# EAGLE design item_2223_Motherboard (EAGLE 7.7.0)

## Sheet 1 of 2
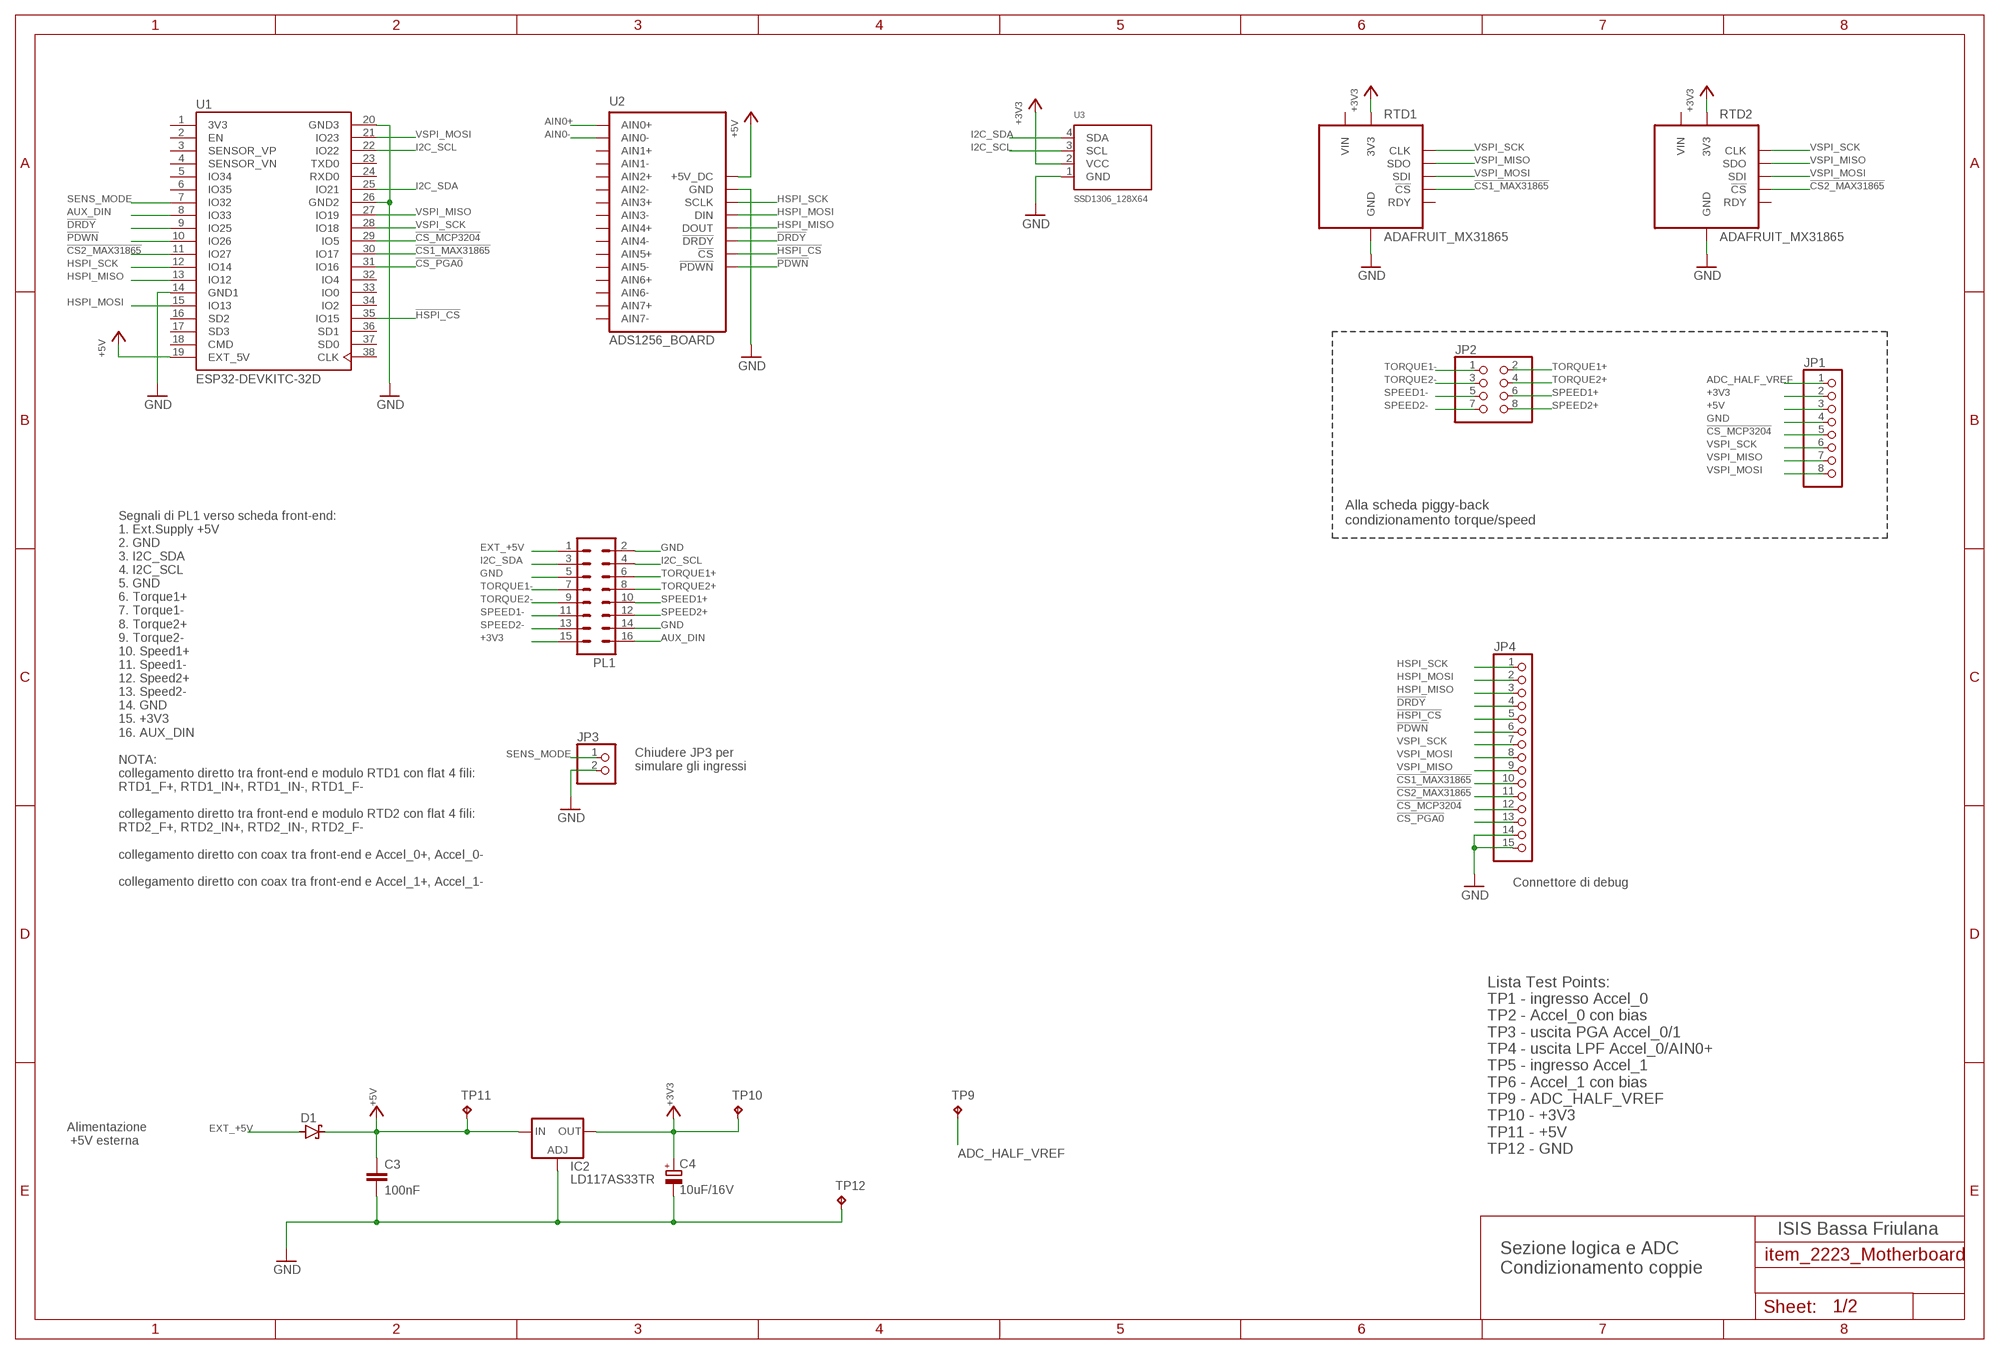
[diagram p0: schematic, sheet 1]

### Parts
C3  100nF  C-EUC0805K  [C0805K]
C4  10uF/16V  CPOL-EUE3.5-8  [E3,5-8]
D1  SCHOTTKY-DIODEDO35-7  [DO35-7]
IC2  LD117AS33TR  [SOT223]
JP1  PINHD-1X8  [1X08]
JP2  PINHD-2X4  [2X04]
JP3  PINHD-1X2  [1X02]
JP4  PINHD-1X15  [1X15]
PL1  16H  [16H]
RTD1  ADAFRUIT_MX31865  [ADAFRUIT_MAX31865]
RTD2  ADAFRUIT_MX31865  [ADAFRUIT_MAX31865]
TP9  TPTP16SQ  [TP16SQ]
TP10  TPTP16SQ  [TP16SQ]
TP11  TPTP16SQ  [TP16SQ]
TP12  TPTP14R  [TP14R]
U1  ESP32-DEVKITC-32D  [MODULE_ESP32-DEVKITC-32D]
U2  ADS1256_BOARD  [ADS1256_BOARD]
U3  SSD1306_128X64  [128X64]

### Nets
!CS1_MAX31865! [digital]: JP4.10 RTD1.P7(!CS!) U1.30(IO17)
!CS2_MAX31865! [digital]: JP4.11 RTD2.P7(!CS!) U1.11(IO27)
!CS_MCP3204! [digital]: JP1.5 JP4.12 U1.29(IO5)
!CS_PGA0! [digital]: JP4.13 U1.31(IO16) ; also sheet 2
!DRDY! [digital]: JP4.4 U1.9(IO25) U2.!DRDY!
!HSPI_CS! [digital]: JP4.5 U1.35(IO15) U2.!CS!
!PDWN! [digital]: JP4.6 U1.10(IO26) U2.PDWN(!PDWN!)
+3V3 [supply]: C4.+ IC2.4(OUT) JP1.2 PL1.15 RTD1.P3(3V3) RTD2.P3(3V3) TP10.TP U3.2(VCC) ; also sheet 2
+5V [supply]: C3.1 D1.C IC2.3(IN) JP1.3 TP11.TP U1.19(EXT_5V) U2.5V_DC(+5V_DC) ; also sheet 2
ADC_HALF_VREF [supply]: JP1.1 TP9.TP ; also sheet 2
AIN0+ [analog]: U2.AIN0+ ; also sheet 2
AIN0- [analog]: U2.AIN0- ; also sheet 2
AUX_DIN [digital]: PL1.16 U1.8(IO33)
EXT_+5V [supply]: D1.A PL1.1
GND [supply]: C3.2 C4.- IC2.1(ADJ) JP1.4 JP3.2 JP4.14 JP4.15 PL1.2 PL1.5 PL1.14 RTD1.P2(GND) RTD2.P2(GND) TP12.TP U1.14(GND1) U1.20(GND3) U1.26(GND2) U2.GND U3.1(GND) ; also sheet 2
HSPI_MISO [digital]: JP4.3 U1.13(IO12) U2.DOUT
HSPI_MOSI [digital]: JP4.2 U1.15(IO13) U2.DIN
HSPI_SCK [digital]: JP4.1 U1.12(IO14) U2.SCLK
I2C_SCL [digital]: PL1.4 U1.22(IO22) U3.3(SCL)
I2C_SDA [digital]: PL1.3 U1.25(IO21) U3.4(SDA)
SENS_MODE [digital]: JP3.1 U1.7(IO32)
SPEED1+ [analog]: JP2.6 PL1.10
SPEED1- [analog]: JP2.5 PL1.11
SPEED2+ [analog]: JP2.8 PL1.12
SPEED2- [analog]: JP2.7 PL1.13
TORQUE1+ [analog]: JP2.2 PL1.6
TORQUE1- [analog]: JP2.1 PL1.7
TORQUE2+ [analog]: JP2.4 PL1.8
TORQUE2- [analog]: JP2.3 PL1.9
VSPI_MISO [digital]: JP1.7 JP4.9 RTD1.P5(SDO) RTD2.P5(SDO) U1.27(IO19)
VSPI_MOSI [digital]: JP1.8 JP4.8 RTD1.P6(SDI) RTD2.P6(SDI) U1.21(IO23) ; also sheet 2
VSPI_SCK [digital]: JP1.6 JP4.7 RTD1.P4(CLK) RTD2.P4(CLK) U1.28(IO18) ; also sheet 2
Unconnected: RTD1.P8(RDY) RTD2.P8(RDY) U1.2(EN) U1.3(SENSOR_VP) U1.4(SENSOR_VN) U1.5(IO34) U1.6(IO35) U1.16(SD2) U1.17(SD3) U1.18(CMD) U1.23(TXD0) U1.24(RXD0) U1.32(IO4) U1.33(IO0) U1.34(IO2) U1.36(SD1) U1.37(SD0) U1.38(CLK) U2.AIN1+ U2.AIN1- U2.AIN2+ U2.AIN2- U2.AIN3+ U2.AIN3- U2.AIN4+ U2.AIN4- U2.AIN5+ U2.AIN5- U2.AIN6+ U2.AIN6- U2.AIN7+ U2.AIN7-

### Notes on the sheet
- Alla scheda piggy-back
  condizionamento torque/speed
- Chiudere JP3 per
  simulare gli ingressi
- Connettore di debug
- Segnali di PL1 verso scheda front-end:
  1. Ext.Supply +5V
  2. GND
  3. I2C_SDA
  4. I2C_SCL
  5. GND
  6. Torque1+
  7. Torque1-
  8. Torque2+
  9. Torque2-
  10. Speed1+
  11. Speed1-
  12. Speed2+
  13. Speed2-
  14. GND
  15. +3V3
  16. AUX_DIN
  
  NOTA:
  collegamento diretto tra front-end e modulo RTD1 con flat 4 fili:
  RTD1_F+, RTD1_IN+, RTD1_IN-, RTD1_F-
  
  collegamento diretto tra front-end e modulo RTD2 con flat 4 fili:
  RTD2_F+, RTD2_IN+, RTD2_IN-, RTD2_F-
  
  collegamento diretto con coax tra front-end e Accel_0+, Accel_0-
  
  collegamento diretto con coax tra front-end e Accel_1+, Accel_1-
- Alimentazione
   +5V esterna
- Lista Test Points:
  TP1 - ingresso Accel_0
  TP2 - Accel_0 con bias
  TP3 - uscita PGA Accel_0/1
  TP4 - uscita LPF Accel_0/AIN0+
  TP5 - ingresso Accel_1
  TP6 - Accel_1 con bias
  TP9 - ADC_HALF_VREF
  TP10 - +3V3
  TP11 - +5V
  TP12 - GND
- ISIS Bassa Friulana
- Sezione logica e ADC
  Condizionamento coppie

## Sheet 2 of 2
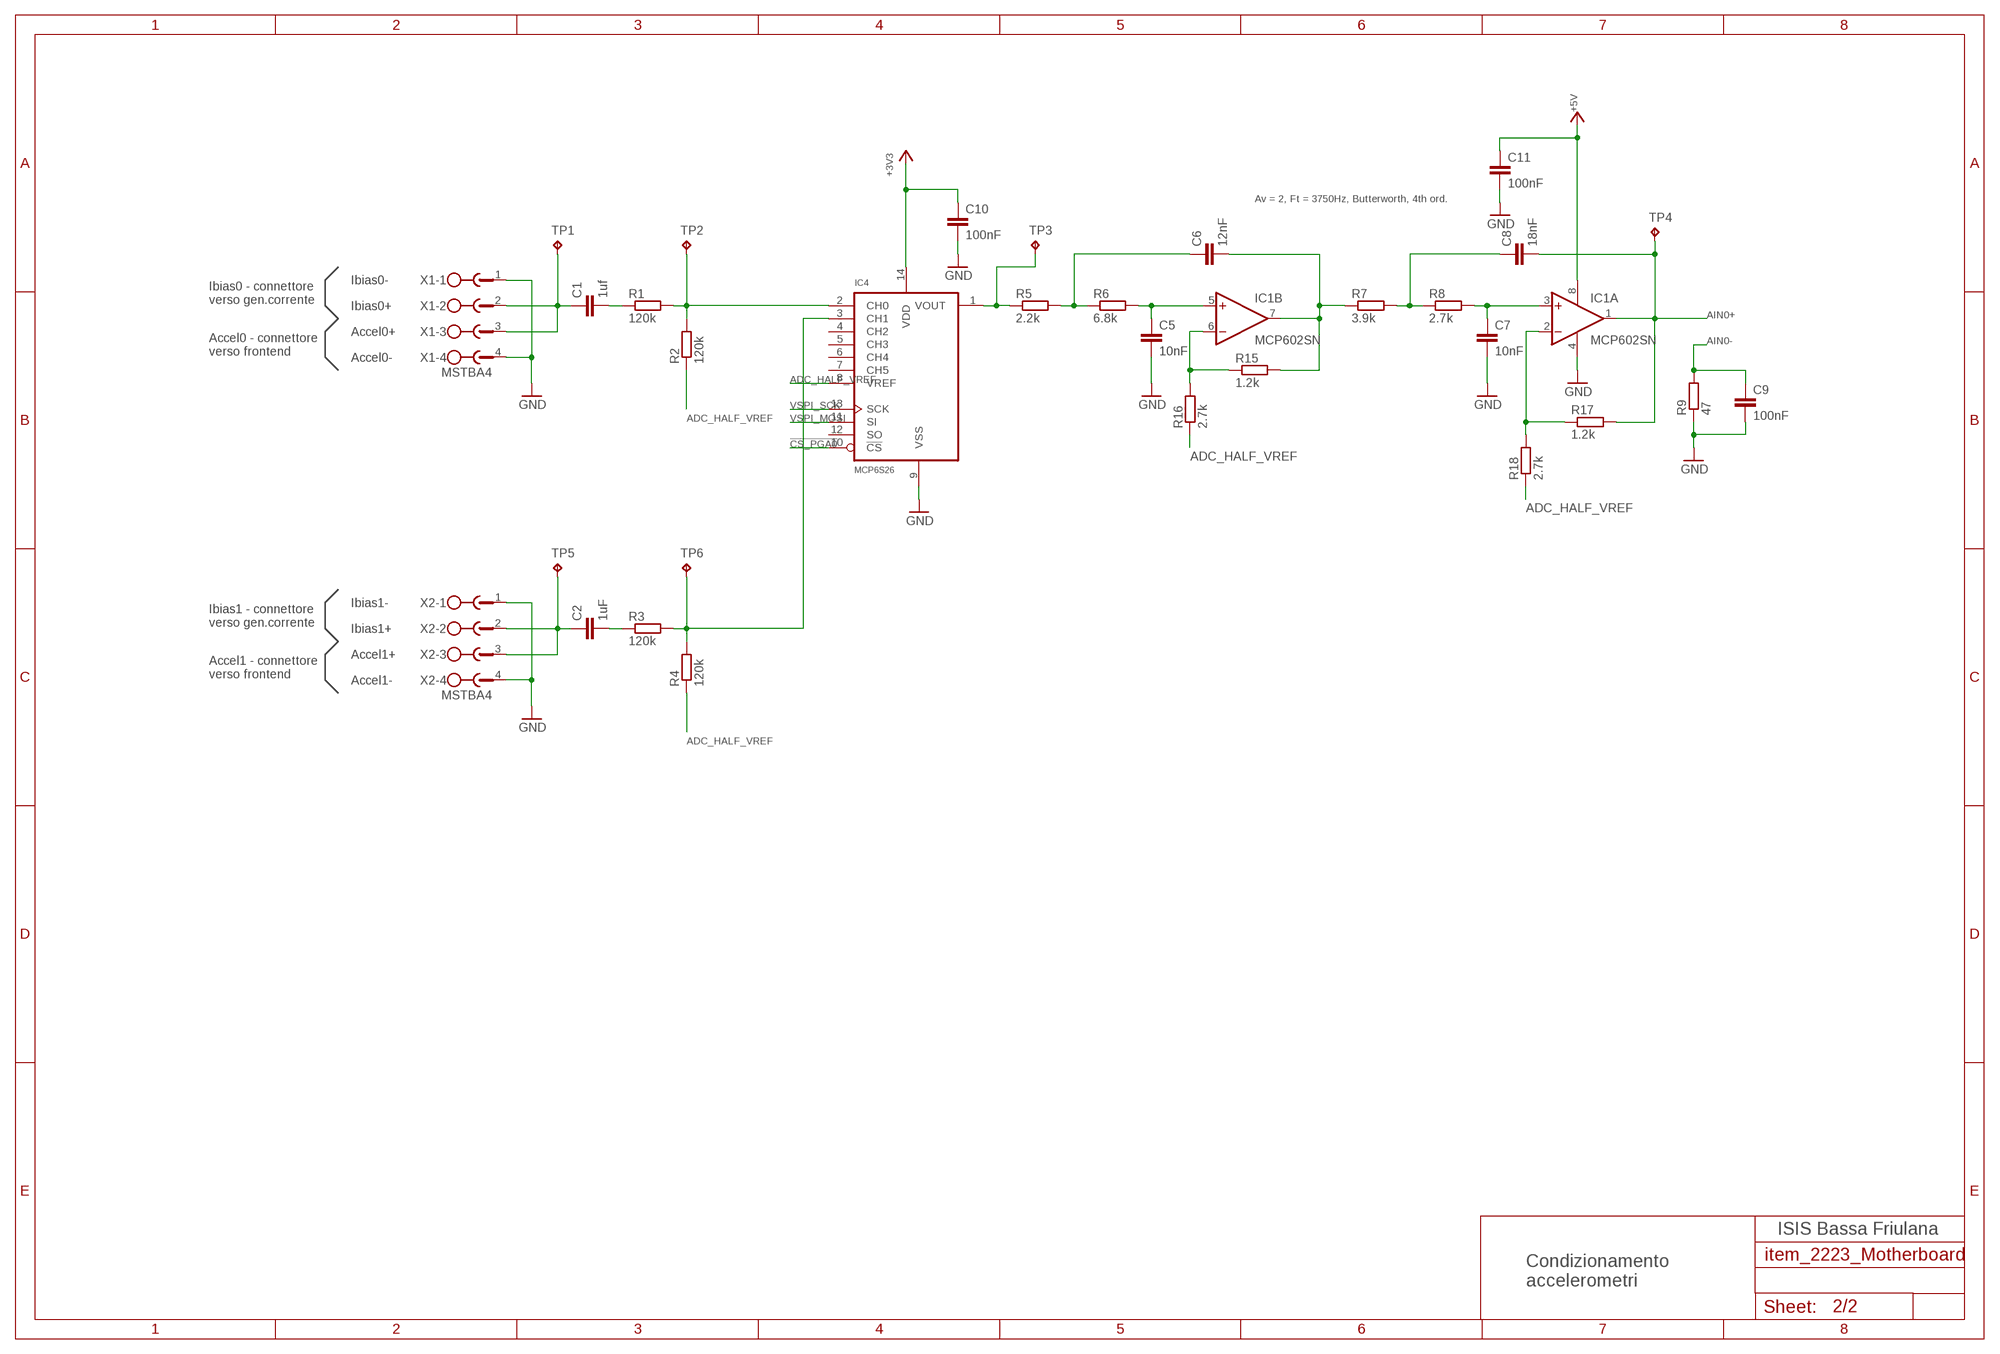
[diagram p1: schematic, sheet 2]

### Parts
C1  1uf  C-EUC1206  [C1206]
C2  1uF  C-EUC1206  [C1206]
C5  10nF  C-EUC0805K  [C0805K]
C6  12nF  C-EUC0805K  [C0805K]
C7  10nF  C-EUC0805K  [C0805K]
C8  18nF  C-EUC0805K  [C0805K]
C9  100nF  C-EUC0805K  [C0805K]
C10  100nF  C-EUC0805K  [C0805K]
C11  100nF  C-EUC0805K  [C0805K]
IC1  MCP602SN  [SO08]
IC4  MCP6S26  [SO14]
R1  120k  R-EU_R0805  [R0805]
R2  120k  R-EU_R0805  [R0805]
R3  120k  R-EU_R0805  [R0805]
R4  120k  R-EU_R0805  [R0805]
R5  2.2k  R-EU_R0805  [R0805]
R6  6.8k  R-EU_R0805  [R0805]
R7  3.9k  R-EU_R0805  [R0805]
R8  2.7k  R-EU_R0805  [R0805]
R9  47  R-EU_R0805  [R0805]
R15  1.2k  R-EU_R0805  [R0805]
R16  2.7k  R-EU_R0805  [R0805]
R17  1.2k  R-EU_R0805  [R0805]
R18  2.7k  R-EU_R0805  [R0805]
TP1  TPTP14R  [TP14R]
TP2  TPTP14R  [TP14R]
TP3  TPTP14R  [TP14R]
TP4  TPTP14R  [TP14R]
TP5  TPTP14R  [TP14R]
TP6  TPTP14R  [TP14R]
X1  MSTBA4  [MSTBA4]
X2  MSTBA4  [MSTBA4]

### Nets
!CS_PGA0! [digital]: IC4.10(!CS!) ; also sheet 1
+3V3 [supply]: C10.1 IC4.14(VDD) ; also sheet 1
+5V [supply]: C11.1 IC1.8(P:V+) ; also sheet 1
ADC_HALF_VREF [supply]: IC4.8(VREF) R2.1 R4.1 R16.1 R18.1 ; also sheet 1
AIN0+ [analog]: C8.2 IC1.1(A:OUT) R17.2 TP4.TP ; also sheet 1
AIN0- [analog]: C9.1 R9.2 ; also sheet 1
GND [supply]: C5.2 C7.2 C9.2 C10.2 C11.2 IC1.4(P:V-) IC4.9(VSS) R9.1 X1.1 X1.4 X2.1 X2.4 ; also sheet 1
N$2 [analog]: C1.1 TP1.TP X1.2 X1.3
N$3 [analog]: C2.1 TP5.TP X2.2 X2.3
N$4 [analog]: IC4.2(CH0) R1.2 R2.2 TP2.TP
N$5 [analog]: IC4.1(VOUT) R5.1 TP3.TP
N$6 [analog]: C1.2 R1.1
N$7: C2.2 R3.1
N$8 [analog]: IC1.6(B:-IN) R15.1 R16.2
N$9 [analog]: C6.1 R5.2 R6.1
N$10 [analog]: C5.1 IC1.5(B:+IN) R6.2
N$11 [analog]: C6.2 IC1.7(B:OUT) R7.1 R15.2
N$12 [analog]: C8.1 R7.2 R8.1
N$13 [analog]: C7.1 IC1.3(A:+IN) R8.2
N$14 [analog]: IC4.3(CH1) R3.2 R4.2 TP6.TP
N$21 [analog]: IC1.2(A:-IN) R17.1 R18.2
VSPI_MOSI [digital]: IC4.11(SI) ; also sheet 1
VSPI_SCK [digital]: IC4.13(SCK) ; also sheet 1
Unconnected: IC4.4(CH2) IC4.5(CH3) IC4.6(CH4) IC4.7(CH5) IC4.12(SO)

### Notes on the sheet
- Av = 2, Ft = 3750Hz, Butterworth, 4th ord.
- Ibias0-
- Ibias0 - connettore 
  verso gen.corrente
- Ibias0+
- Accel0+
- Accel0 - connettore 
  verso frontend
- Accel0-
- Ibias1-
- Ibias1 - connettore 
  verso gen.corrente
- Ibias1+
- Accel1+
- Accel1 - connettore 
  verso frontend
- Accel1-
- ISIS Bassa Friulana
- Condizionamento
  accelerometri

## Power pins joined to a net without a drawn wire
3V3: U1.1(3V3)
VIN: RTD1.P1(VIN) RTD2.P1(VIN)

## Library data of the parts
C1-C3 C5-C11 = rcl:C-EU: CAPACITOR, European symbol; SPICEPREFIX: C
C4 = rcl@1:CPOL-EU: POLARIZED CAPACITOR, European symbol
D1 = diode:SCHOTTKY-DIODE: Schottky Diode
IC1 = linear:MCP602: Single Op Amp 2.7V to 6.0V Single Supply CMOS Source: http://ww1.microchip.com/downloads/en/DeviceDoc/21314g.pdf
IC2 = v-reg:LD117A?*: Low drop fixed and adjustable positive voltage regulators 1 A Source: http://www.st.com/stonline/products/literature/ds/7194/ld1117axx.pdf
IC4 = microchip_opamp:MCP6S26: MCP6S26 Six channels analog Programmable Gain Amplifier with SPI interface
JP1 = pinhead:PINHD-1X8: PIN HEADER
JP2 = pinhead:PINHD-2X4: PIN HEADER
JP3 = pinhead:PINHD-1X2: PIN HEADER
JP4 = pinhead:PINHD-1X15: PIN HEADER
PL1 = con-harting-h:16H: CONNECTOR; OC_FARNELL: unknown; OC_NEWARK: unknown
R1-R9 R15-R18 = rcl:R-EU_: RESISTOR, European symbol; SPICEPREFIX: R
RTD1 RTD2 = Adafruit_MAX31865_RTD:ADAFRUIT_MX31865: Adafruit MAX31865 - Adafruit MAX31865 RTD PT100 or PT1000 Amplifier
TP1-TP6 TP9-TP12 = testpad:TP: Test pad
U1 = ESP32-DEVKITC-32D:ESP32-DEVKITC-32D: Eval Board For Esp-Wroom-32 Check prices <https://pricing.snapeda.com/parts/ESP32-DEVKITC-32D/Espressif%20Systems/view-part?ref=eda>; AVAILABILITY: Warning; DESCRIPTION: WiFi Development Tools (802.11) ESP32 General Development Kit, ESP32-WROOM-32D on the board; MF: Espressif Systems; MP: ESP32-DEVKITC-32D; PACKAGE: None; PRICE: None; PURCHASE-URL: https://pricing.snapeda.com/search/part/ESP32-DEVKITC-32D/?ref=eda
U2 = ADS1256:ADS1256_BOARD: Board 8 Channels - ADS1256 24bit
U3 = ssd1306oled:SSD1306_128X64: OLED Display Board 0.91" 128x64 White I2C - 4 Pins - SSD1306
X1 X2 = con-phoenix-508:MSTBA4: PHOENIX; MF: FARNELL; MPN: 1757268; OC_FARNELL: 3705195; OC_NEWARK: 71C4163

## Net classes
1 supply: width 0.762 mm, drill 0.508 mm, clearance 0.406 mm to class 0, clearance 0.406 mm
2 digital: width 0.305 mm, drill 0.305 mm, clearance 0.305 mm to class 0, clearance 0.305 mm to class 1, clearance 0.305 mm
3 analog: width 0.508 mm, drill 0.508 mm, clearance 0.406 mm to class 0, clearance 0.406 mm to class 1, clearance 0.406 mm to class 2, clearance 0.406 mm

## Board
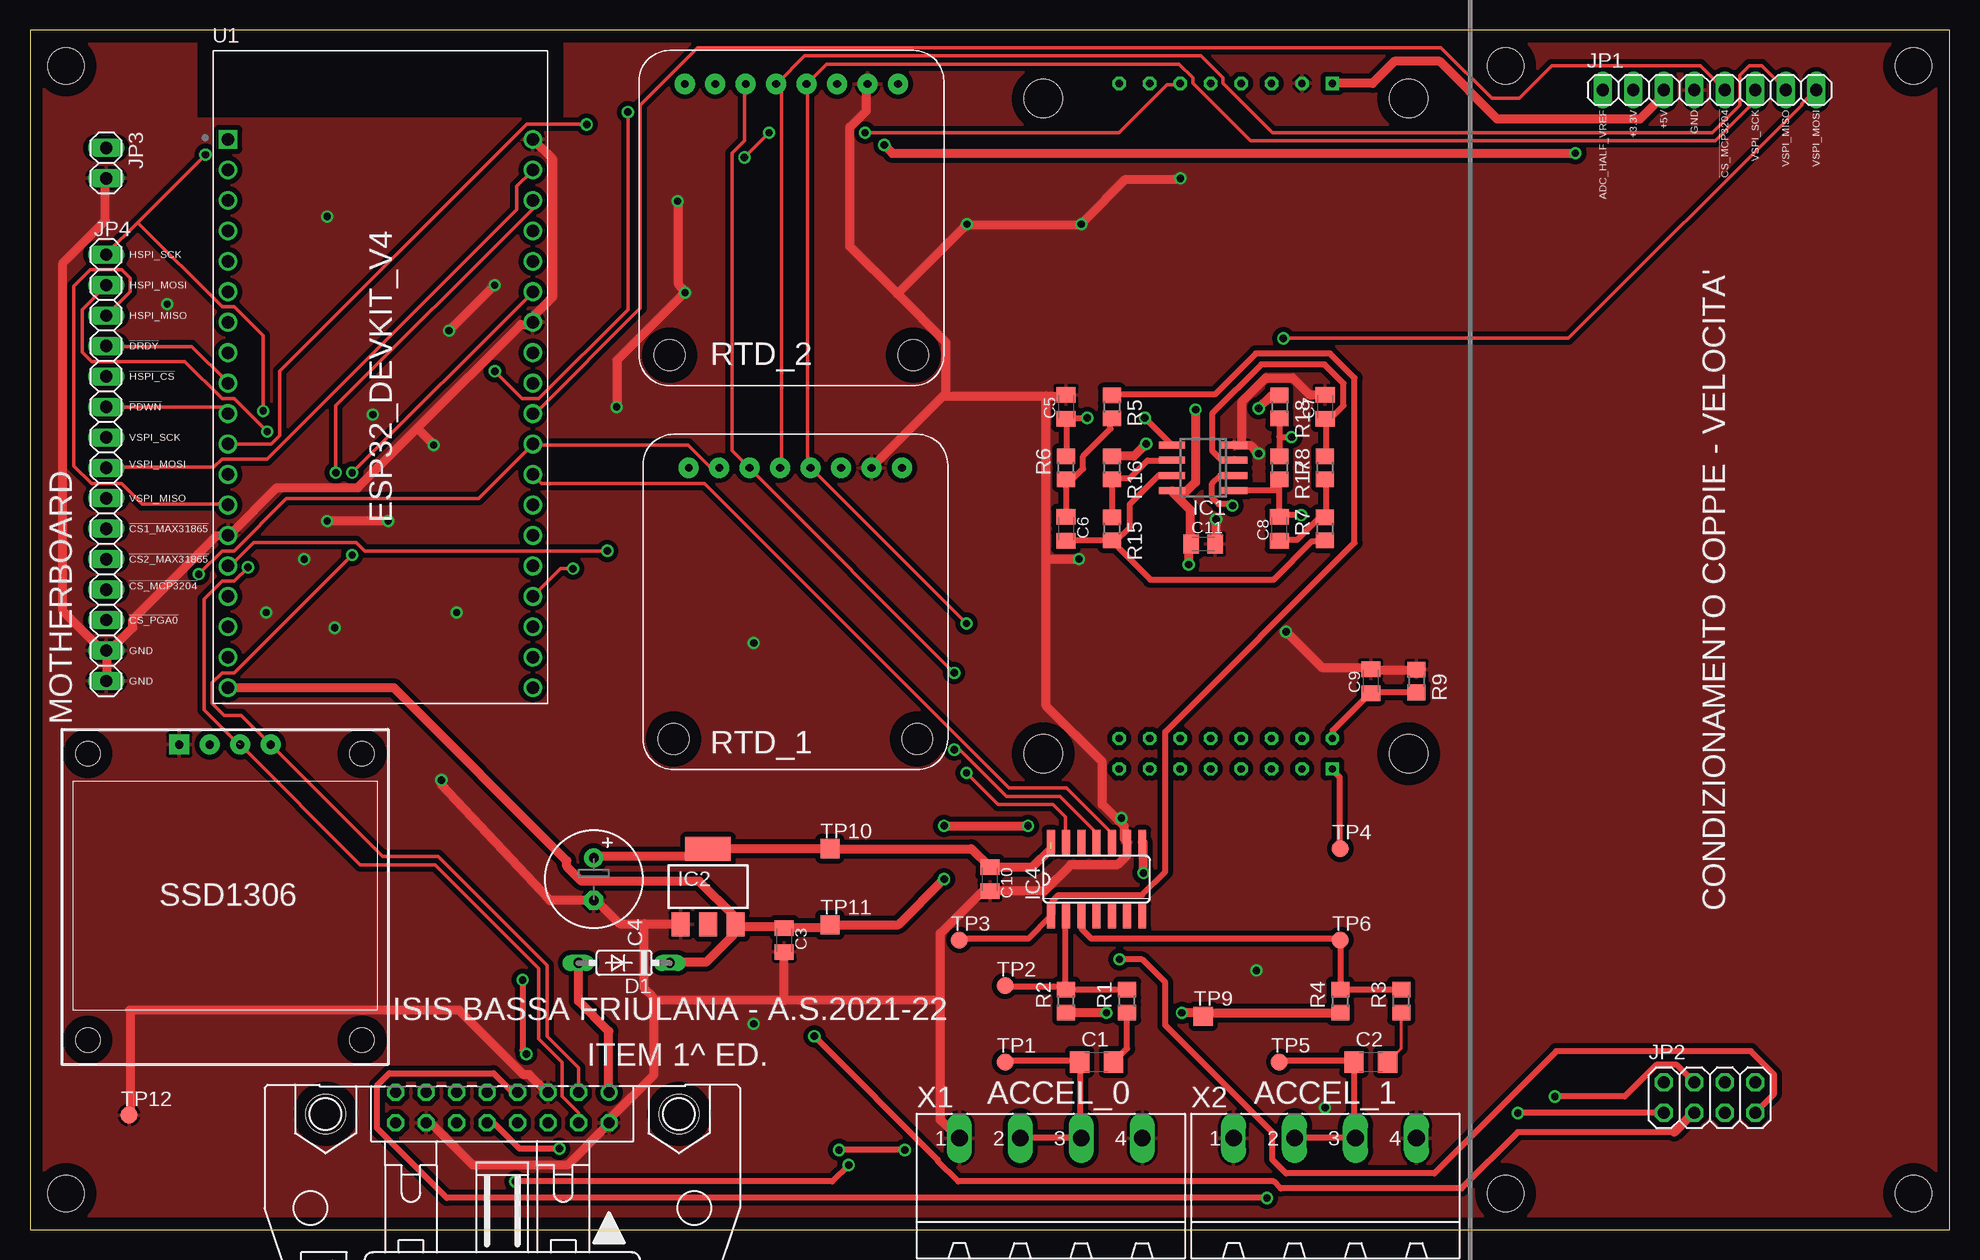
[diagram p2: board, top side]
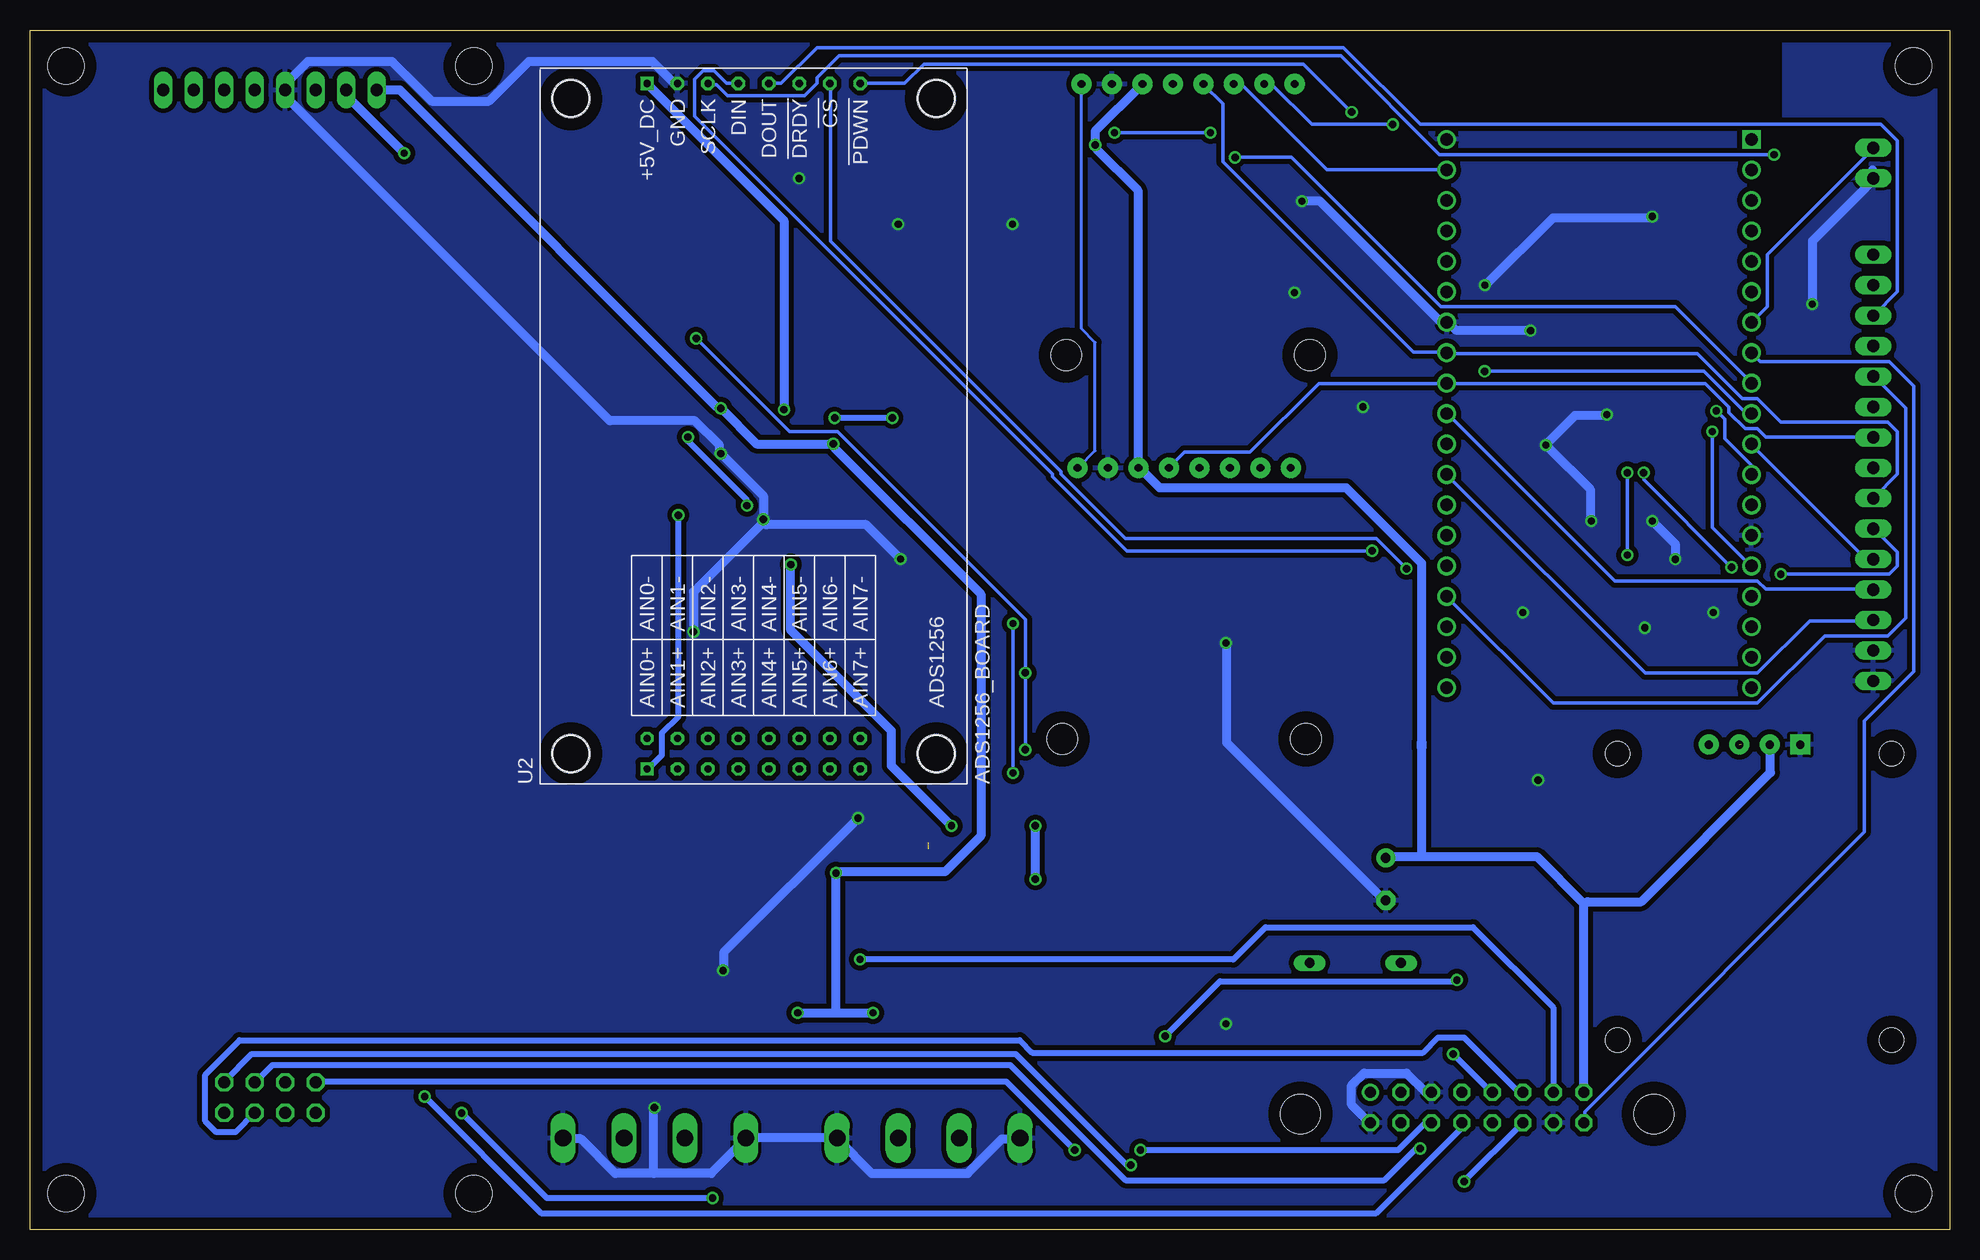
[diagram p3: board, bottom side, seen from below]

Size 160 x 100 mm. Coordinates in mm from the lower left corner, seen from the top.
Outline: 0,0 160,0 160,100 0,100 0,0
Copper layers (1*16): Top 0.035mm / dielectric 1.5mm / Bottom 0.035mm
Design rules "default": minimum track width 10mil, minimum drill 24mil, track to track 8mil, track to pad 8mil, pad to pad 8mil, via to via 8mil, smd to smd 8mil, copper to edge 40mil, drill to drill 8mil, minimum pad ring 10mil, minimum via ring 8mil, stop-mask expansion 4mil, vias tented up to drill 0mil, thermal gap 10mil
Holes 3 mm at 157,97 157,3 123,97 123,3 3,97 3,3
Holes 3.2 mm at 84.45,39.67 114.92,39.67 114.92,94.28 84.45,94.28
tKeepout: area -1.3,99.1 to 161.3,101.6; area -1.3,-1.3 to 1.3,101.6; area -1.3,-1.3 to 161.3,1.3; area 158.8,-1.3 to 161.3,101.6
bKeepout: area -1.3,-1.3 to 1.3,100.3; area -1.3,-1.3 to 161.3,1.3; area 158.8,-2.5 to 161.3,101.6; area -1.3,99.1 to 161.3,101.6
tRestrict: area 14,92.7 to 44.5,100.3
bRestrict: area 14,92.7 to 44.5,100.3

### Footprints (pad centres in the part's own frame; a part is rotated, then mirrored left to right if it is on the bottom)
C1206 = smd 1.6 x 1.8: 1 -1.4,0; 2 1.4,0
C0805K = smd 1.3 x 1.6: 1 -1,0; 2 1,0
E3,5-8 = drill 0.813 pad 1.6: + -1.778,0 | drill 0.813 pad 1.6 octagon: - 1.778,0
DO35-7 = drill 0.813 long: A 3.81,0; C -3.81,0
SO08 = smd 0.6 x 2.2: 1 -1.905,-2.6; 2 -0.635,-2.6; 3 0.635,-2.6; 4 1.905,-2.6; 5 1.905,2.6; 6 0.635,2.6; 7 -0.635,2.6; 8 -1.905,2.6
SOT223 = smd 1.5 x 2: 1 -2.3,-3.15; 2 0,-3.15; 3 2.3,-3.15 | smd 3.8 x 2: 4 0,3.15
SO14 = smd 0.66 x 2.032: 1 -3.81,-3.073; 2 -2.54,-3.073; 3 -1.27,-3.073; 4 0,-3.073; 5 1.27,-3.073; 6 2.54,-3.073; 7 3.81,-3.073; 8 3.81,3.073; 9 2.54,3.073; 10 1.27,3.073; 11 0,3.073; 12 -1.27,3.073; 13 -2.54,3.073; 14 -3.81,3.073
1X08 = drill 1.016 long: 1 -8.89,0; 2 -6.35,0; 3 -3.81,0; 4 -1.27,0; 5 1.27,0; 6 3.81,0; 7 6.35,0; 8 8.89,0
2X04 = drill 1.016 octagon: 1 -3.81,-1.27; 2 -3.81,1.27; 3 -1.27,-1.27; 4 -1.27,1.27; 5 1.27,-1.27; 6 1.27,1.27; 7 3.81,-1.27; 8 3.81,1.27
1X02 = drill 1.016 long: 1 -1.27,0; 2 1.27,0
1X15 = drill 1.016 long: 1 -17.78,0; 2 -15.24,0; 3 -12.7,0; 4 -10.16,0; 5 -7.62,0; 6 -5.08,0; 7 -2.54,0; 8 0,0; 9 2.54,0; 10 5.08,0; 11 7.62,0; 12 10.16,0; 13 12.7,0; 14 15.24,0; 15 17.78,0
16H = drill 0.914: 1 -8.89,-1.27 | drill 0.914 octagon: 2 -8.89,1.27; 3 -6.35,-1.27; 4 -6.35,1.27; 5 -3.81,-1.27; 6 -3.81,1.27; 7 -1.27,-1.27; 8 -1.27,1.27; 9 1.27,-1.27; 10 1.27,1.27; 11 3.81,-1.27; 12 3.81,1.27; 13 6.35,-1.27; 14 6.35,1.27; 15 8.89,-1.27; 16 8.89,1.27 | hole 3.302: -14.732,0.533; 14.732,0.533
R0805 = smd 1.3 x 1.5: 1 -0.95,0; 2 0.95,0
ADAFRUIT_MAX31865 = drill 0.65 pad 1.676: P1 -8.89,-10.16; P2 -6.35,-10.16; P3 -3.81,-10.16; P4 -1.27,-10.16; P5 1.27,-10.16; P6 3.81,-10.16; P7 6.35,-10.16; P8 8.89,-10.16 | hole 2.54: -10.16,12.446; 10.16,12.446
TP14R = smd 1.4 x 1.4: TP 0,0
TP16SQ = smd 1.6 x 1.6: TP 0,0
MODULE_ESP32-DEVKITC-32D = drill 1.04 square: 1 -12.7,19.76 | drill 1.04: 2 -12.7,17.22; 3 -12.7,14.68; 4 -12.7,12.14; 5 -12.7,9.6; 6 -12.7,7.06; 7 -12.7,4.52; 8 -12.7,1.98; 9 -12.7,-0.56; 10 -12.7,-3.1; 11 -12.7,-5.64; 12 -12.7,-8.18; 13 -12.7,-10.72; 14 -12.7,-13.26; 15 -12.7,-15.8; 16 -12.7,-18.34; 17 -12.7,-20.88; 18 -12.7,-23.42; 19 -12.7,-25.96; 20 12.7,19.76; 21 12.7,17.22; 22 12.7,14.68; 23 12.7,12.14; 24 12.7,9.6; 25 12.7,7.06; 26 12.7,4.52; 27 12.7,1.98; 28 12.7,-0.56; 29 12.7,-3.1; 30 12.7,-5.64; 31 12.7,-8.18; 32 12.7,-10.72; 33 12.7,-13.26; 34 12.7,-15.8; 35 12.7,-18.34; 36 12.7,-20.88; 37 12.7,-23.42; 38 12.7,-25.96
ADS1256_BOARD = drill 0.6 square: 5V_DC 27.94,7.62; AIN0+ -29.21,7.62 | drill 0.6 octagon: !CS! 27.94,-7.62; !DRDY! 27.94,-5.08; AIN0- -26.67,7.62; AIN1+ -29.21,5.08; AIN1- -26.67,5.08; AIN2+ -29.21,2.54; AIN2- -26.67,2.54; AIN3+ -29.21,0; AIN3- -26.67,0; AIN4+ -29.21,-2.54; AIN4- -26.67,-2.54; AIN5+ -29.21,-5.08; AIN5- -26.67,-5.08; AIN6+ -29.21,-7.62; AIN6- -26.67,-7.62; AIN7+ -29.21,-10.16; AIN7- -26.67,-10.16; DIN 27.94,0; DOUT 27.94,-2.54; GND 27.94,5.08; PDWN 27.94,-10.16; SCLK 27.94,2.54
128X64 = drill 0.7 pad 1.676 square: 1 -3.81,12.7 | drill 0.7 pad 1.676: 2 -1.27,12.7; 3 1.27,12.7; 4 3.81,12.7 | hole 2.032: -11.43,11.938; -11.43,-11.938; 11.43,11.938; 11.43,-11.938
MSTBA4 = drill 1.397 long: 1 -7.62,5.08; 2 -2.54,5.08; 3 2.54,5.08; 4 7.62,5.08

### Placement (x,y rotation side)
C1  88.9,13.97 0 top
C2  111.76,13.97 0 top
C3  62.87,24.13 270 top
C4  46.99,29.21 270 top
C5  86.36,68.58 90 top
C6  86.36,58.42 270 top
C7  107.95,68.58 90 top
C8  104.14,58.42 90 top
C9  111.76,45.72 90 top
C10  80.01,29.21 270 top
C11  97.79,57.15 0 top
D1  49.53,22.23 180 top
IC1  97.79,63.5 90 top
IC2  56.52,28.57 0 top
IC4  88.9,29.21 0 top
JP1  140,95 0 top
JP2  140,11 0 top
JP3  6.35,88.9 270 top
JP4  6.35,63.5 270 top
PL1  39.37,10.16 180 top
R1  91.44,19.05 90 top
R2  86.36,19.05 90 top
R3  114.3,19.05 90 top
R4  109.22,19.05 90 top
R5  90.17,68.58 270 top
R6  86.36,63.5 90 top
R7  107.95,58.42 90 top
R8  107.95,63.5 90 top
R9  115.57,45.72 270 top
R15  90.17,58.42 270 top
R16  90.17,63.5 270 top
R17  104.14,63.5 270 top
R18  104.14,68.58 270 top
RTD1  63.8,53.34 180 top
RTD2  63.47,85.34 180 top
TP1  81.28,13.97 0 top
TP2  81.28,20.32 0 top
TP3  77.47,24.13 0 top
TP4  109.22,31.75 0 top
TP5  104.14,13.97 0 top
TP6  109.22,24.13 0 top
TP9  97.79,17.78 0 top
TP10  66.67,31.75 0 top
TP11  66.67,25.4 0 top
TP12  8.26,9.53 0 top
U1  29.21,71.12 0 top
U2  100.95,67.61 90 bottom
U3  16.25,27.73 0 top
X1  85.09,2.54 0 top
X2  107.95,2.54 0 top

### Tracks (layer width: path | path; a pad name or v marks a point on that pad's centre or on a via)
!CS1_MAX31865!  (via drill 0.61)
  Top 0.305: v14.06,54.63 16,56.58 17.03,56.58 21.37,60.92 37.38,60.92 41.83,65.38 U1.30 41.95,65.38 54.86,65.38 56.69,63.55 57.38,63.55 RTD1.P7
  Bottom 0.305: v14.06,54.63 5.03,54.63 4.34,55.32 4.34,56.46 6.29,58.41 JP4.10
!CS2_MAX31865!  (via drill 0.61)
  Top 0.305: v46.41,92.13 41.38,92.13 20.8,71.55 20.8,66.18 20.12,65.49 16.57,65.49 U1.11
  Bottom 0.305: JP4.11 6.4,55.89 6.97,55.89 16.46,65.38 U1.11 | v46.41,92.13 53.15,92.13 56.46,95.44 57.04,95.44 RTD2.P7
!CS_MCP3204!
  Top 0.305: JP1.5 141.16,95.1 139.22,97.04 126.87,97.04 124.13,94.3 121.84,94.3 117.61,98.53 55.66,98.53 50.86,93.73 50.86,76.81 42.18,68.12 41.95,68.12 U1.29
  Bottom 0.305: JP4.12 6.4,53.38 15.32,53.38 16,54.06 27.89,54.06 41.83,68.01 U1.29
!CS_PGA0!
  Top 0.305: IC4.10 90.07,32.35 90.07,33.15 86.41,36.8 81.61,36.8 56.24,62.18 42.63,62.18 41.95,62.87 U1.31
  Bottom 0.305: JP4.13 6.4,50.75 11.66,50.75 16,46.41 25.38,46.41 41.83,62.87 U1.31
!DRDY!  (via drill 0.61)
  Top 0.305: v69.61,91.44 90.75,91.44 94.75,95.44 95.78,95.44 U2.!DRDY! | v59.55,89.38 v61.61,91.44 | JP4.4 6.4,73.61 13.49,73.61 16.46,70.64 U1.9
  Bottom 0.305: v61.61,91.44 v69.61,91.44 | v59.55,89.38 54.86,89.38 42.41,76.92 22.86,76.92 16.57,70.64 U1.9
!HSPI_CS!  (via drill 0.61)
  Top 0.305: v45.26,55.09 44.23,55.09 41.95,52.81 U1.35
  Bottom 0.305: v45.26,55.09 47.78,57.61 68.69,57.61 74.07,62.98 74.07,63.21 93.27,82.41 93.27,95.44 U2.!CS! | JP4.5 6.29,71.09 3.66,68.47 3.66,50.98 5.14,49.49 10.4,49.49 16,43.89 33.03,43.89 41.83,52.69 U1.35
!PDWN!  (via drill 0.61)
  Top 0.305: v49.84,93.15 49.84,76.69 42.41,69.27 41.03,69.27 v38.75,71.55 | JP4.6 16,68.58 16.46,68.12 U1.10
  Bottom 0.305: v49.84,93.15 53.84,97.16 85.5,97.16 87.1,95.56 90.75,95.56 U2.PDWN | v38.75,71.55 20.46,71.55 17.03,68.12 16.57,68.12 U1.10
+3V3  (via drill 0.61)  (1 unrouted)
  Top 0.762: v128.82,89.72 71.89,89.72 v71.21,90.41 | C4.+ 47.09,31.09 55.78,31.09 56.24,31.55 IC2.4 56.58,31.77 66.64,31.77 TP10.TP 78.47,31.75 C10.1 83.55,30.21 85.09,31.75
  Bottom 0.762: 30.52,27.2 30.52,11.43 PL1.15 | 30.52,27.2 30.18,27.32 25.7,27.32 14.92,38.1 14.92,40.37 U3.2 | v128.82,89.72 133.62,94.53 133.62,94.98 JP1.2 | RTD2.P3 67.32,95.44 71.21,91.55 v71.21,90.41 71.09,90.07 67.67,86.64 67.67,63.55 RTD1.P3 67.32,63.32 65.84,61.84 50.29,61.84 44.01,55.55 44.01,40.59 | C4.+ 46.98,31.09 44.13,31.09 | 44.13,31.09 34.4,31.09 30.52,27.2 | 44.01,40.2 44.01,31.22 44.13,31.09
  Bottom 0.813: 44.01,40.59 44.01,40.2
+5V  (via drill 0.61)
  Top 0.762: 95.78,60.92 95.21,61.49 IC1.8 | 95.78,60.92 96.7,60.01 96.7,57.15 C11.1 96.58,56.81 v96.58,55.44 | U2.5V_DC 108.58,95.56 111.9,95.56 113.73,97.38 117.5,97.38 122.3,92.58 134.19,92.58 136.13,94.53 136.13,94.98 JP1.3 | 95.78,60.92 97.16,62.29 v97.16,68.35 | 66.64,25.49 TP11.TP | D1.C 53.38,22.29 56.35,22.29 58.64,24.57 58.64,25.15 IC2.3 | 66.98,25.6 TP11.TP | TP11.TP 66.41,25.15 62.87,25.15 C3.1 62.52,25.26 59.09,25.26 IC2.3 | U1.19 16.57,45.15 30.34,45.15 44.74,30.75 44.74,30.29 46,29.03 55.78,29.03 58.64,26.18 58.64,25.72 IC2.3 | v76.2,29.21 72.39,25.4 TP11.TP | v76.2,33.66 v83.19,33.66
  Bottom 0.762: v97.16,68.35 97.16,84.12 108.47,95.44 U2.5V_DC | v96.58,55.44 96.58,49.96 88.19,41.57 88.19,38.66 v83.19,33.66 | v76.2,29.21 v76.2,33.66
ADC_HALF_VREF  (via drill 0.61)
  Top 0.762: v89.72,18.06 86.41,18.06 R2.1 | v96.01,18.06 97.5,18.06 97.73,17.83 TP9.TP 97.95,18.06 109.16,18.06 R4.1 | v92.81,29.72 92.81,32.23 IC4.8 | v93.04,65.49 92.01,64.47 90.18,64.47 R16.1 | v102.41,68.47 103.44,69.49 104.13,69.49 R18.1
  Bottom 0.762: v96.01,18.06 92.81,18.06 | 92.81,18.06 v89.72,18.06 | 92.81,18.06 v92.81,29.72 92.47,29.83 83.74,29.83 80.75,32.83 80.75,52.97 92.93,65.15 v93.04,65.49 99.44,65.49 v102.41,68.47 102.76,68.58 129.16,94.98 131.1,94.98 JP1.1
AIN0+  (via drill 0.61)
  Top 0.508: 104.13,61.61 104.13,59.44 C8.2 104.36,59.55 v105.96,59.55 | 104.13,61.61 104.13,62.52 R17.2 | 104.13,61.61 100.47,61.61 IC1.1 | TP4.TP 109.16,31.77 109.16,37.72 108.58,38.29 U2.AIN0+
  Bottom 0.508: v105.96,59.55 105.96,42.75 107.33,41.38 107.33,39.55 108.47,38.41 U2.AIN0+
AIN0-
  Top 0.508: R9.2 115.56,44.81 111.78,44.81 C9.1 111.56,44.58 108.58,41.6 108.58,41.03 U2.AIN0-
AUX_DIN
  Bottom 0.305: PL1.16 30.4,8.91 30.4,9.83 7.09,33.15 7.09,42.41 2.97,46.52 2.97,70.29 5.03,72.35 15.77,72.35 16.46,73.04 U1.8
EXT_+5V
  Top 0.762: PL1.1 48.23,11.43 48.23,16.54 45.72,19.05 D1.A
GND  (via drill 0.6, 0.61)
  Top 0.762: TP12.TP 8.34,9.6 8.34,18.29 35.78,18.29 41.15,12.92 41.6,12.92 43.09,11.43 PL1.5 | U1.20 41.95,90.87 43.55,89.27 43.55,77.72 41.95,76.12 41.95,75.67 U1.26 41.6,75.44 40.92,75.44 32.29,66.81 | JP4.14 6.4,48.23 6.4,45.72 JP4.15 6.51,45.38 | JP3.2 6.29,87.55 6.29,84.12 2.74,80.58 2.74,51.55 6.06,48.23 JP4.14 | JP4.14 6.74,48.35 8.57,50.18 8.57,50.86 15.54,57.84 16.46,57.84 U1.14 16.8,58.06 20.57,61.84 27.32,61.84 32.29,66.81 | R9.1 115.56,46.63 111.78,46.63 C9.2 111.44,46.86 107.67,46.86 v104.7,49.84 | v98.87,59.21 98.87,57.15 C11.2 | v102.41,64.69 101.73,65.38 101.04,65.38 | 101.04,65.38 100.47,65.38 IC1.4 | 101.04,65.38 101.04,69.04 102.98,70.98 105.27,70.98 106.64,69.61 107.9,69.61 C7.2 | 76.35,69.49 76.12,69.49 70.18,63.55 RTD1.P2 | 76.35,69.49 84.7,69.49 | 84.7,69.49 86.3,69.49 C5.2 | 72.3,78.01 76.35,73.95 76.35,69.49 | 72.3,78.01 68.35,81.95 68.35,91.9 69.72,93.27 69.72,95.44 RTD2.P2 | PL1.14 33.03,8.8 33.49,8.8 36.92,5.37 44.81,5.37 48.23,8.8 PL1.2 48.35,9.26 52.01,12.92 52.01,19.09 | 75.89,19.09 75.89,9.14 77.38,7.66 X1.1 | 75.89,19.09 75.89,24.69 79.32,28.12 79.67,28.12 C10.2 80.01,28.23 84.58,28.23 86.75,30.4 90.64,30.4 91.44,31.2 IC4.9 91.21,32.58 91.21,33.6 90.75,34.06 | 75.89,19.09 62.87,19.09 | 62.87,19.09 52.01,19.09 | 84.7,55.89 84.7,43.66 89.38,38.98 89.38,35.43 90.75,34.06 | 84.7,55.89 84.7,69.49 | 84.7,55.89 v87.44,55.89 | v34.29,37.47 34.29,37.12 43.34,27.43 C4.- 47.32,27.32 49.15,25.49 51.21,25.49 | 51.21,25.49 54.18,25.49 IC2.1 | v38.73,78.74 v34.92,74.93 | v48.9,68.58 48.92,68.58 48.92,72.47 54.52,78.07 v54.61,78.11 54.41,78.41 54.06,78.75 54.06,85.72 v53.98,85.72
  Top 0.762: v29.84,59.05 29.83,59.09 24.8,59.09 v24.77,59.05 | v90.98,34.29 90.75,34.06 | 72.3,78.01 v78.11,83.82 78.41,83.78 87.55,83.78 v87.63,83.82 87.9,84.12 91.33,87.55 95.78,87.55 v95.89,87.63 | 62.87,19.09 C3.2 | 32.29,66.81 33.6,65.49 v33.66,65.41 | 51.21,25.49 51.21,20.12 51.89,19.43 52.01,19.09
  Bottom 0.762: U2.GND 106.07,95.56 106.3,95.56 108.13,97.38 118.42,97.38 121.73,94.07 126.53,94.07 129.84,97.38 136.82,97.38 138.65,95.56 138.65,95.1 JP1.4 138.65,94.64 138.65,94.41 111.67,67.44 104.58,67.44 102.53,65.38 102.53,65.04 v102.41,64.69 98.87,61.15 v98.87,59.21 | v104.7,49.84 104.7,53.15 98.98,58.86 v98.87,59.21 | PL1.5 43.66,11.43 45.26,13.03 48.81,13.03 49.84,12 49.84,10.4 48.35,8.91 PL1.2 | X1.1 77.5,7.54 78.98,7.54 81.84,4.69 89.84,4.69 92.7,7.54 X1.4 93.04,7.66 100.24,7.66 X2.1 100.58,7.32 103.21,4.69 108.01,4.69 | 108.01,4.69 111.21,4.69 114.07,7.54 115.56,7.54 X2.4 | v87.44,55.89 90.3,58.75 98.64,58.75 v98.87,59.21 | JP3.2 6.4,87.67 6.4,87.68 | 6.4,88.35 JP3.2 | v60.33,48.9 60.24,48.81 60.24,40.58 47.09,27.43 C4.- | v24.77,84.45 24.8,84.35 33.03,84.35 38.63,78.75 v38.73,78.74 | v22.86,55.88 22.86,57.15 v24.77,59.05 | v28.57,67.94 28.57,67.89 31.2,67.89 33.6,65.49 v33.66,65.41 33.38,65.15 29.95,61.72 29.95,59.09 v29.84,59.05 | 108.01,4.69 108.01,10.06 v107.95,10.16 | v90.98,34.29 102.18,23.09 102.18,21.6 v102.23,21.59 | v11.43,77.15 11.43,82.41 6.51,87.33 JP3.2 | v53.98,85.72 52.46,85.72 42.41,75.67 41.95,75.67 U1.26 41.6,75.44 41.15,74.98 34.98,74.98 v34.92,74.93
  other vias: 19.68,51.44 25.4,50.16 35.56,51.44 60.33,17.14
  pour Bottom: -5.08,104.14 164.47,104.14 164.47,-5.08 -5.08,-5.08
  pour Top: -5.08,104.78 165.74,104.78 165.74,-5.08 -5.08,-5.08
HSPI_MISO
  Top 0.305: U1.13 16.46,60.47 9.37,60.47 7.66,62.18 5.14,62.18 3.66,63.66 3.66,78.64 5.03,80.01 7.66,80.01 8.34,79.32 8.34,78.18 6.4,76.24 JP4.3
  Bottom 0.305: U2.DOUT 98.3,95.56 97.38,95.56 94.41,98.53 50.52,98.53 44.12,92.13 5.71,92.13 4.34,90.75 4.34,78.18 6.29,76.24 JP4.3
HSPI_MOSI  (via drill 0.61)
  Top 0.305: v48.12,56.58 27.89,56.58 27.2,57.26 18.63,57.26 16.57,55.21 U1.15 | v19.77,66.52 17.03,69.27 16,69.27 12.92,72.35 5.14,72.35 4.34,73.15 4.34,76.69 6.29,78.64 JP4.2
  Bottom 0.305: v48.12,56.58 68.58,56.58 74.75,62.75 74.75,62.98 104.58,92.81 104.58,95.9 103.9,96.58 102.98,96.58 101.96,95.56 101.04,95.56 U2.DIN | v19.77,66.52 19.77,58.52 16.57,55.32 U1.15
HSPI_SCK  (via drill 0.61)
  Top 0.305: 8.97,83.95 6.4,81.38 JP4.1 | 8.97,83.95 v14.63,89.61 | v19.43,68.24 19.43,74.52 17.03,76.92 16,76.92 8.97,83.95
  Bottom 0.305: v14.63,89.61 42.52,89.61 50.75,97.84 92.58,97.84 94.41,96.01 94.41,95.56 95.44,94.53 101.84,94.53 102.76,95.44 103.44,95.44 U2.SCLK | v19.43,68.24 18.75,67.55 18.75,65.95 16.57,63.78 16.57,62.98 U1.12
I2C_SCL  (via drill 0.61)  (1 unrouted)
  Top 0.305: PL1.4 45.72,9.72 44.35,11.09 44.35,13.95 42.41,15.89 42.41,21.78 33.78,30.4 27.54,30.4 U3.3 | v25.49,63.09 25.49,68.69 41.83,85.04 41.83,85.72 U1.22 | v18.17,55.21 17.03,54.06 16,54.06 14.52,52.58 14.52,43.32 17.37,40.46
  Bottom 0.305: v25.49,63.09 25.49,62.52 v18.17,55.21
I2C_SDA  (via drill 0.61)
  Top 0.305: PL1.3 45.72,13.49 43.09,16.12 43.09,22.01 34.01,31.09 29.38,31.09 29.38,31.11 U3.4 17.62,42.86 16.19,42.86 15.2,43.85 15.2,45.61 16,46.41 17.03,46.41 v26.86,56.24 | v26.86,63.09 41.83,78.07 U1.25
  Bottom 0.305: v26.86,56.24 v26.86,63.09
N$2
  Top 0.508: TP1.TP 81.38,14.06 87.44,14.06 C1.1 87.55,13.72 87.55,7.66 X1.3 87.33,7.66 82.64,7.66 X1.2
N$3
  Top 0.508: TP5.TP 104.24,14.06 110.3,14.06 C2.1 110.41,13.72 110.41,7.66 X2.3 110.19,7.66 105.5,7.66 X2.2
N$4
  Top 0.508: TP2.TP 81.38,20.23 86.07,20.23 86.3,20 R2.2 | R1.2 86.53,20 R2.2 | IC4.2 86.3,26.06 86.3,20.34 R2.2
N$5
  Top 0.508: TP3.TP 77.5,24.23 83.21,24.23 85.04,26.06 IC4.1 85.27,26.29 85.27,27.43 85.72,27.89 92.7,27.89 94.64,29.83 94.64,41.49 110.41,57.26 110.41,70.98 108.36,73.04 102.18,73.04 98.75,69.61 90.18,69.61 R5.1
N$6
  Top 0.508: R1.1 91.44,15.09 90.41,14.06 C1.2
N$7
  Top 0.254: R3.1 114.3,15.09 113.27,14.06 C2.2
N$8
  Top 0.508: R15.1 90.18,59.44 90.18,62.52 R16.2 90.41,62.64 91.67,62.64 93.15,64.12 95.1,64.12 IC1.6
N$9
  Top 0.508: C6.1 86.41,59.44 86.41,62.52 R6.1 86.64,62.64 86.98,62.64 87.78,63.44 87.78,64.47 90.07,66.75 90.07,67.55 R5.2
N$10  (via drill 0.61)
  Top 0.508: R6.2 86.41,64.47 86.41,67.55 C5.1 86.64,67.67 v88.12,67.67 | v92.93,67.67 95.1,65.49 IC1.5
  Bottom 0.508: v88.12,67.67 v92.93,67.67
N$11
  Top 0.508: R15.2 90.07,57.49 86.41,57.49 C6.2 | R7.1 107.9,57.38 106.87,57.38 103.67,54.18 93.38,54.18 90.3,57.26 R15.2 | IC1.7 94.07,62.87 91.67,60.47 91.67,58.52 90.53,57.38 R15.2
N$12
  Top 0.508: R8.1 108.01,62.52 108.01,59.44 R7.2 107.78,59.21 107.33,59.21 105.61,57.49 104.24,57.49 C8.1
N$13
  Top 0.508: R8.2 108.01,64.47 108.01,67.55 C7.1 108.24,67.44 109.5,68.69 109.5,70.52 107.9,72.12 102.64,72.12 98.53,68.01 98.53,64.92 99.21,64.24 100.36,64.24 IC1.3
N$14
  Top 0.508: R3.2 109.5,20 R4.2 109.27,20 109.27,24.12 TP6.TP 109.04,24.23 88.47,24.23 87.67,25.03 87.67,26.06 IC4.3
N$21  (via drill 0.61)
  Top 0.508: 104.13,66.06 104.13,67.55 R18.2 | 104.13,66.06 104.13,64.47 R17.1 | IC1.2 99.21,62.87 98.53,62.18 98.53,61.04 99.1,60.47 100.13,60.47 v100.24,60.35 | 104.13,66.06 v105.16,66.06
  Bottom 0.508: v100.24,60.35 100.24,60.81 105.16,65.72 v105.16,66.06
SENS_MODE
  Bottom 0.305: JP3.1 6.4,90.07 15.2,81.27 15.2,76.92 16.46,75.67 U1.7
SPEED1+  (via drill 0.61)
  Top 0.508: v44.12,6.74 40.8,6.74 38.75,8.8 38.18,8.8 PL1.10
  Bottom 0.508: v44.12,6.74 44.46,6.74 47.09,4.12 68.69,4.12 78.3,13.72 139.79,13.72 141.16,12.34 JP2.6
SPEED1-
  Bottom 0.508: 35.89,11.43 40.46,16 42.63,16 43.89,14.74 76.47,14.74 77.5,15.77 142.53,15.77 145.39,12.92 145.39,9.03 144.47,8.12 142.88,8.12 141.28,9.72
  Bottom 0.762: 35.89,11.43 PL1.11 | 141.28,9.72 JP2.5
SPEED2+  (via drill 0.61)
  Top 0.508: v40.46,4 66.86,4 v68.24,5.37
  Bottom 0.508: v40.46,4 35.66,8.8 PL1.12 | v68.24,5.37 68.58,5.37 77.84,14.63 141.5,14.63 143.79,12.34 JP2.8
SPEED2-  (via drill 0.61)
  Top 0.508: v90.81,22.52 92.71,22.52 94.64,20.59 94.64,17.03 103.56,8.12 103.56,5.83 104.7,4.69 117.04,4.69 127.22,14.86 143.45,14.86 145.39,12.92 145.39,11.32 143.9,9.83
  Top 0.762: 143.9,9.83 JP2.7
  Bottom 0.508: 33.03,11.43 33.03,18.52 39.71,25.2 57.01,25.2 59.69,22.52 v90.81,22.52
  Bottom 0.762: 33.03,11.43 PL1.13
TORQUE1+  (via drill 0.61)
  Top 0.508: v72.92,6.63 v67.44,6.63
  Bottom 0.508: v67.44,6.63 45.95,6.63 43.78,8.8 43.2,8.8 PL1.6 | v72.92,6.63 78.64,12.34 136.13,12.34 JP2.2
TORQUE1-  (via drill 0.61)
  Top 0.508: 40.23,11.43 38.63,13.03 29.95,13.03 28.92,12 28.92,8.46 34.75,2.63 v103.1,2.63 | 136.13,9.72 v124.02,9.72
  Top 0.762: 40.23,11.43 PL1.7 | 136.13,9.72 JP2.1
  Bottom 0.508: v103.1,2.63 116.93,2.63 v124.02,9.72
TORQUE2+  (via drill 0.61)
  Top 0.508: v127.1,11.09 132.93,11.09 135.56,13.72 137.27,13.72 138.65,12.34 JP2.4
  Bottom 0.508: v127.1,11.09 117.39,1.37 47.78,1.37 40.69,8.46 40.69,8.8 PL1.8
TORQUE2-  (via drill 0.61)
  Top 0.508: v41.06,20.8 41.06,14.95 v41.38,14.63 | v65.38,16.12 75.67,5.83 75.67,5.71 77.38,4 103.67,4 104.24,3.43 119.33,3.43 124.02,8.12 137.05,8.12
  Top 0.762: 137.05,8.12 138.65,9.72 JP2.3
  Bottom 0.508: PL1.9 38.18,11.43 v41.38,14.63 | v65.38,16.12 60.81,20.69 41.4,20.69 v41.06,20.8
VIN
  Bottom 0.254: RTD2.P1 72.35,95.44 72.35,75.09 71.21,73.95 71.21,64.92 72.58,63.55 RTD1.P1
VSPI_MISO
  Top 0.305: JP1.7 146.3,95.1 144.36,97.04 143.33,97.04 142.53,96.24 142.53,93.73 140.25,91.44 103.56,91.44 99.44,95.56 99.44,96.01 97.61,97.84 64.58,97.84 62.29,95.56 RTD2.P5 62.29,95.44 62.64,95.1 62.64,63.55 RTD1.P5
  Bottom 0.305: JP4.9 6.29,61.04 4.34,62.98 4.34,66.52 5.14,67.32 14.06,67.32 16,69.27 17.26,69.27 21.03,73.04 41.83,73.04 U1.27 42.06,73.15 44.69,73.15 60.58,89.04 60.58,93.84 62.18,95.44 RTD2.P5
VSPI_MOSI  (via drill 0.61)
  Top 0.305: JP4.8 6.4,63.55 15.32,63.55 16,64.24 19.77,64.24 40.58,85.04 40.58,86.98 41.83,88.24 U1.21 | v77.04,40.01 77.5,40.01 81.38,36.12 85.84,36.12 88.81,33.15 88.81,32.35 IC4.11 | v77.04,46.41 60.01,63.44 RTD1.P6 59.89,63.55 58.52,64.92 58.52,89.72 59.55,90.75 59.55,95.44 RTD2.P6 | v104.47,74.3 128.25,74.3 147.68,93.73 147.68,93.84 148.82,94.98 JP1.8
  Bottom 0.305: RTD2.P6 59.55,95.44 58.98,95.44 51.89,88.35 41.95,88.35 U1.21 | v77.04,40.01 v77.04,46.41 77.04,50.86 92.7,66.52 96.7,66.52 v104.47,74.3
VSPI_SCK  (via drill 0.61)
  Top 0.305: JP1.6 143.79,94.98 143.79,94.07 140.47,90.75 101.73,90.75 96.93,95.56 96.93,96.01 95.78,97.16 66.41,97.16 64.81,95.56 RTD2.P4 64.81,95.44 64.81,63.66 64.92,63.55 RTD1.P4 65.15,63.44 v78.07,50.52 | v78.07,38.06 80.7,35.43 85.27,35.43 86.3,34.4 86.3,32.35 IC4.13
  Bottom 0.305: JP4.7 6.4,66.06 15.32,66.06 16,66.75 17.03,66.75 18.4,68.12 18.4,68.58 20.34,70.52 41.83,70.52 U1.28 41.95,70.52 52.58,70.52 58.29,64.81 63.78,64.81 65.04,63.55 RTD1.P4 | v78.07,50.52 v78.07,38.06

### Text on the board
tPlace: ADC_HALF_VREF | +3.3V | +5V | GND | !CS_MCP3204! | VSPI_SCK | VSPI_MISO | VSPI_MOSI | HSPI_SCK | HSPI_MOSI | HSPI_MISO | !DRDY! | !HSPI_CS! | !PDWN! | VSPI_SCK | VSPI_MOSI | VSPI_MISO | !CS1_MAX31865! | !CS2_MAX31865! | !CS_MCP3204! | !CS_PGA0! | GND | GND
tNames: RTD_2 | ESP32_DEVKIT_V4 | MOTHERBOARD | CONDIZIONAMENTO COPPIE - VELOCITA' | RTD_1 | SSD1306 | ISIS BASSA FRIULANA - A.S.2021-22 | ITEM 1^ ED. | ACCEL_0 | ACCEL_1